# Altium schematic sheet Drivers.SchDoc
size A4
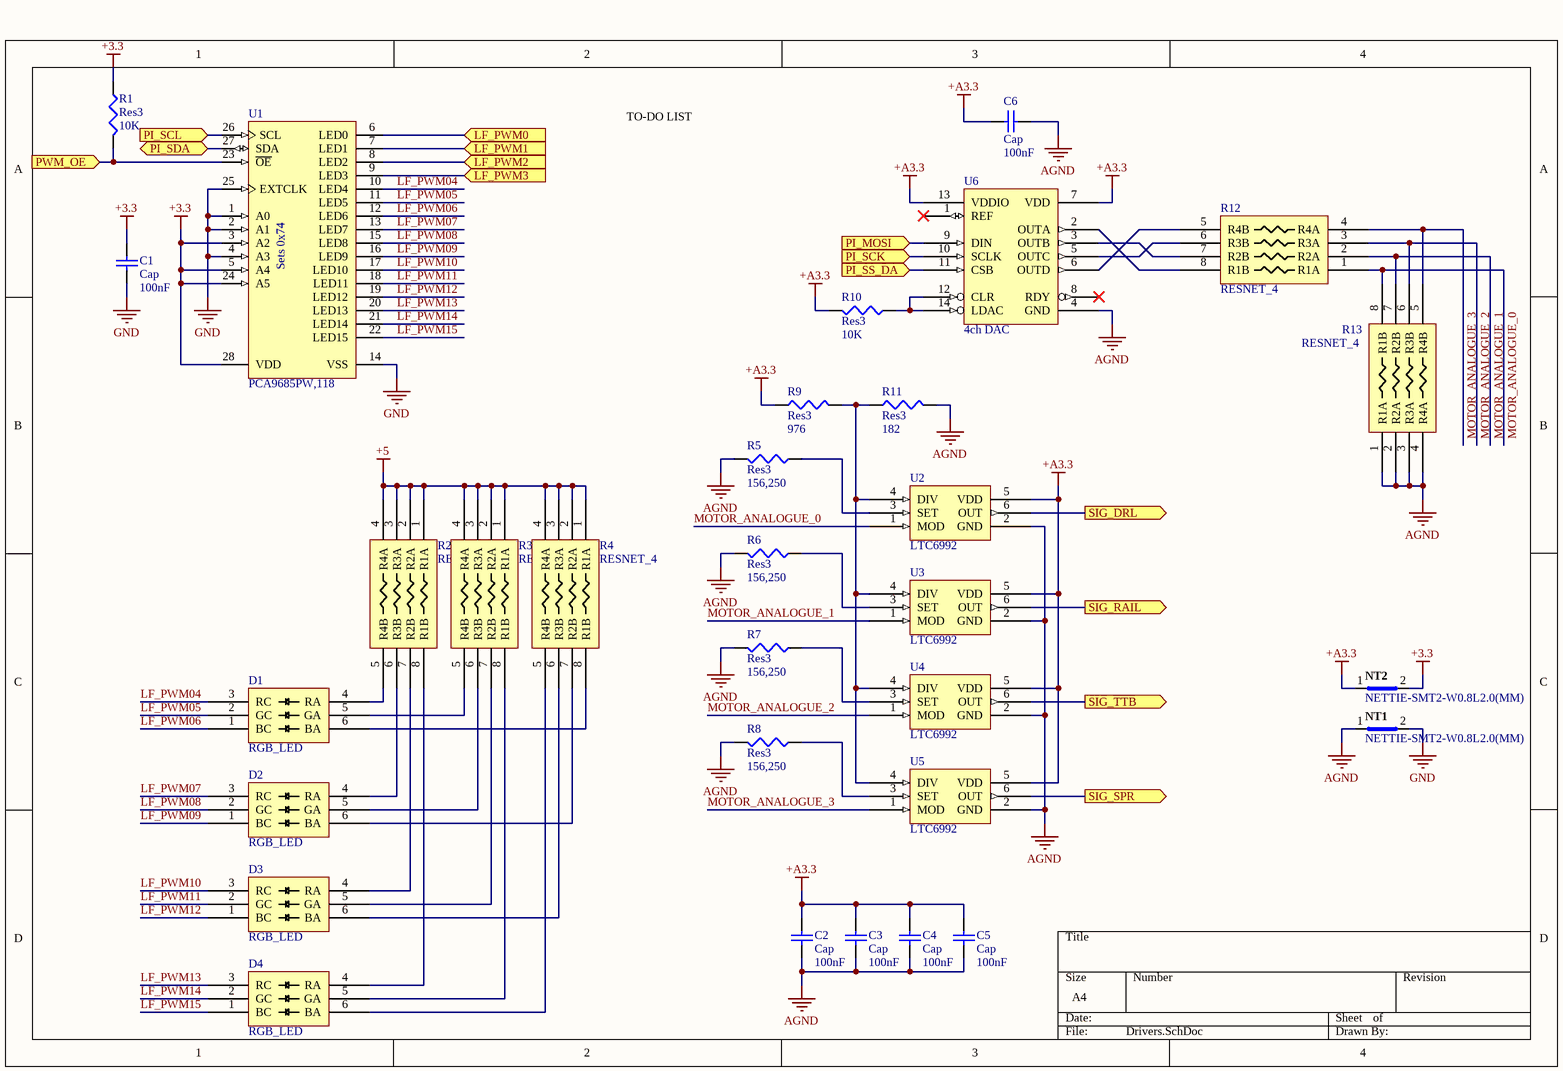
[diagram p0: Drivers.SchDoc]

## Parts
C1  Cap  value 100nF  [C0805]
C2  Cap  value 100nF  [C0805]
C3  Cap  value 100nF  [C0805]
C4  Cap  value 100nF  [C0805]
C5  Cap  value 100nF  [C0805]
C6  Cap  value 100nF  [C0805]
D1  RGB_LED  [SLV6A-FKB]
D2  RGB_LED  [SLV6A-FKB]
D3  RGB_LED  [SLV6A-FKB]
D4  RGB_LED  [SLV6A-FKB]
NT1  NETTIE-SMT2-W0.8L2.0(MM)  [NETTIE-SMT2-W0.8L2.0(MM)]  (net tie, no BOM)
NT2  NETTIE-SMT2-W0.8L2.0(MM)  [NETTIE-SMT2-W0.8L2.0(MM)]  (net tie, no BOM)
R1  Res3  value 10K  [C0805]
R2  RESNET_4  [744C083]
R3  RESNET_4  [744C083]
R4  RESNET_4  [744C083]
R5  Res3  value 156,250  [C0805]
R6  Res3  value 156,250  [C0805]
R7  Res3  value 156,250  [C0805]
R8  Res3  value 156,250  [C0805]
R9  Res3  value 976  [C0805]
R10  Res3  value 10K  [C0805]
R11  Res3  value 182  [C0805]
R12  RESNET_4  [CAY16F4]
R13  RESNET_4  [CAY16F4]
U1  PCA9685PW,118  [SOT361-1_V]
U2  LTC6992  [LTC6992]
U3  LTC6992  [LTC6992]
U4  LTC6992  [LTC6992]
U5  LTC6992  [LTC6992]
U6  4ch DAC  [MAX5715]

## Ports
LF_PWM0 (in), LF_PWM1 (in), LF_PWM2 (in), LF_PWM3 (in), PI_MOSI (in), PI_SCK (in), PI_SCL (in), PI_SDA (bidir), PI_SS_DA (in), PWM_OE (in), SIG_DRL (out), SIG_RAIL (out), SIG_SPR (out), SIG_TTB (out)

## Nets
+3.3: C1.2 NT2.2(Net2) R1.1 U1.3(A2) U1.5(A4) U1.24(A5) U1.28(VDD)
+5: R2.1(R1A) R2.2(R2A) R2.3(R3A) R2.4(R4A) R3.1(R1A) R3.2(R2A) R3.3(R3A) R3.4(R4A) R4.1(R1A) R4.2(R2A) R4.3(R3A) R4.4(R4A)
+A3.3: C2.2 C3.2 C4.2 C5.2 C6.2 NT2.1(Net1) R9.1 R10.2 U2.5(VDD) U3.5(VDD) U4.5(VDD) U5.5(VDD) U6.7(VDD) U6.13(VDDIO)
AGND: C2.1 C3.1 C4.1 C5.1 C6.1 NT1.1(Net1) R5.2 R6.2 R7.2 R8.2 R11.2 R13.1(R1A) R13.2(R2A) R13.3(R3A) R13.4(R4A) U2.2(GND) U3.2(GND) U4.2(GND) U5.2(GND) U6.4(GND)
GND: C1.1 NT1.2(Net2) U1.1(A0) U1.2(A1) U1.4(A3) U1.14(VSS) U1.25(EXTCLK)
LF_PWM0: U1.6(LED0) ; port LF_PWM0
LF_PWM1: U1.7(LED1) ; port LF_PWM1
LF_PWM2: U1.8(LED2) ; port LF_PWM2
LF_PWM3: U1.9(LED3) ; port LF_PWM3
LF_PWM04: D1.3(RC) U1.10(LED4)
LF_PWM05: D1.2(GC) U1.11(LED5)
LF_PWM06: D1.1(BC) U1.12(LED6)
LF_PWM07: D2.3(RC) U1.13(LED7)
LF_PWM08: D2.2(GC) U1.15(LED8)
LF_PWM09: D2.1(BC) U1.16(LED9)
LF_PWM10: D3.3(RC) U1.17(LED10)
LF_PWM11: D3.2(GC) U1.18(LED11)
LF_PWM12: D3.1(BC) U1.19(LED12)
LF_PWM13: D4.3(RC) U1.20(LED13)
LF_PWM14: D4.2(GC) U1.21(LED14)
LF_PWM15: D4.1(BC) U1.22(LED15)
MOTOR_ANALOGUE_0: R12.1(R1A) R13.8(R1B) U2.1(MOD)
MOTOR_ANALOGUE_1: R12.2(R2A) R13.7(R2B) U3.1(MOD)
MOTOR_ANALOGUE_2: R12.3(R3A) R13.6(R3B) U4.1(MOD)
MOTOR_ANALOGUE_3: R12.4(R4A) R13.5(R4B) U5.1(MOD)
PI_MOSI: U6.9(DIN) ; port PI_MOSI
PI_SCK: U6.10(SCLK) ; port PI_SCK
PI_SCL: U1.26(SCL) ; port PI_SCL
PI_SDA: U1.27(SDA) ; port PI_SDA
PI_SS_DA: U6.11(CSB) ; port PI_SS_DA
PWM_OE: R1.2 U1.23(~{OE}) ; port PWM_OE
SIG_DRL: U2.6(OUT) ; port SIG_DRL
SIG_RAIL: U3.6(OUT) ; port SIG_RAIL
SIG_SPR: U5.6(OUT) ; port SIG_SPR
SIG_TTB: U4.6(OUT) ; port SIG_TTB
NetD1_4: D1.4(RA) R2.5(R4B)
NetD1_5: D1.5(GA) R3.5(R4B)
NetD1_6: D1.6(BA) R4.8(R1B)
NetD2_4: D2.4(RA) R2.6(R3B)
NetD2_5: D2.5(GA) R3.6(R3B)
NetD2_6: D2.6(BA) R4.7(R2B)
NetD3_4: D3.4(RA) R2.7(R2B)
NetD3_5: D3.5(GA) R3.7(R2B)
NetD3_6: D3.6(BA) R4.6(R3B)
NetD4_4: D4.4(RA) R2.8(R1B)
NetD4_5: D4.5(GA) R3.8(R1B)
NetD4_6: D4.6(BA) R4.5(R4B)
NetR5_1: R5.1 U2.3(SET)
NetR6_1: R6.1 U3.3(SET)
NetR7_1: R7.1 U4.3(SET)
NetR8_1: R8.1 U5.3(SET)
NetR9_2: R9.2 R11.1 U2.4(DIV) U3.4(DIV) U4.4(DIV) U5.4(DIV)
NetR10_1: R10.1 U6.12(CLR) U6.14(LDAC)
NetR12_5: R12.5(R4B) U6.6(OUTD)
NetR12_6: R12.6(R3B) U6.5(OUTC)
NetR12_7: R12.7(R2B) U6.3(OUTB)
NetR12_8: R12.8(R1B) U6.2(OUTA)

Not connected (* = marked no-connect by the designer): U6 1(REF)* 8(RDY)*

## Notes on the sheet
- TO-DO LIST
- (near U1) Sets 0x74

## Library data of the parts
C1-C6 = Cap: Capacitor; Published: 8-Jun-2000; LatestRevisionDate: 17-Jul-2002; LatestRevisionNote: Re-released for DXP Platform.; PackageReference: RAD-0.3; Publisher: Altium Limited; PackageDescription: Radial Cap, Thru-Hole; 2 Leads; 0.3 in Pin Spacing
D1-D4 = RGB_LED: RGB LED
NT1 NT2 = CMP-0488-00002-2: Net-Tie, Surface Mount, 2.0 mm x 0.8 mm, 2 Pads (1.2 mm x 0.8 mm); Manufacturer: No Vendor; PartNumber: NETTIE-SMT2-W0.8L2.0(MM)
R1 R5-R11 = Res3: Resistor; Published: 8-Jun-2000; LatestRevisionDate: 29-May-2009; LatestRevisionNote: IPC-7351 Footprint Added.; PackageReference: J1-0603; Publisher: Altium Limited; PackageDescription: Chip Resistor
R2 = RESNET_4: 4-Resistor Network; Value: 150
R3 R4 = RESNET_4: 4-Resistor Network; Value: 100
R12 = RESNET_4: 4-Resistor Network; Value: 15K
R13 = RESNET_4: 4-Resistor Network; Value: 10K
U1 = CMP-1595-00003-2: 16-Channel, 12-Bit PWM Fm+ I2C-Bus LED Controller, 2.3 to 5.5 V, -40 to 85 degC, 28-Pin TSSOP (SOT361-1), RoHS, Tape and Reel; Supply Current Max: 10 mA; Supply Voltage Min: 2.3 V; Supply Voltage Max: 5.5 V; Frequency: 25000000 Hz; Temperature Max: 85 degC; ComponentLink1URL: http://www.nxp.com/; ComponentLink3Description: Package Specification; PackageVersion: 02/2003; ComponentLink2Description: Datasheet; Code_JEDEC: MO-153; RoHS: TRUE; Mounting Technology: Surface Mount; PackageDescription: 28-Pin Small Outline Package, Body 9.7 x 4.4 mm, Pitch 0.65 mm; ComponentLink2URL: http://www.nxp.com/documents/data_sheet/PCA9685.pdf; Packing: Tape and Reel; ComponentLink1Description: Manufacturer URL; PartNumber: PCA9685; ComponentLink3URL: http://www.nxp.com/documents/outline_drawing/sot361-1_po.pdf; DatasheetVersion: Rev. 4; Temperature Min: -40 degC
U2-U5 = LTC6992: Voltage-Controlled Pulse / Width Modulator (PWM)
U6 = MAX5715: Ultra-Small, Quad-Channel, 8-/10-/12-Bit Buffered / Output DACs with Internal Reference and SPI Interface